# Altium schematic sheet POWERDIST_DARNET_2022.SchDoc
size B; SheetNumber: 1; SheetTotal: 1
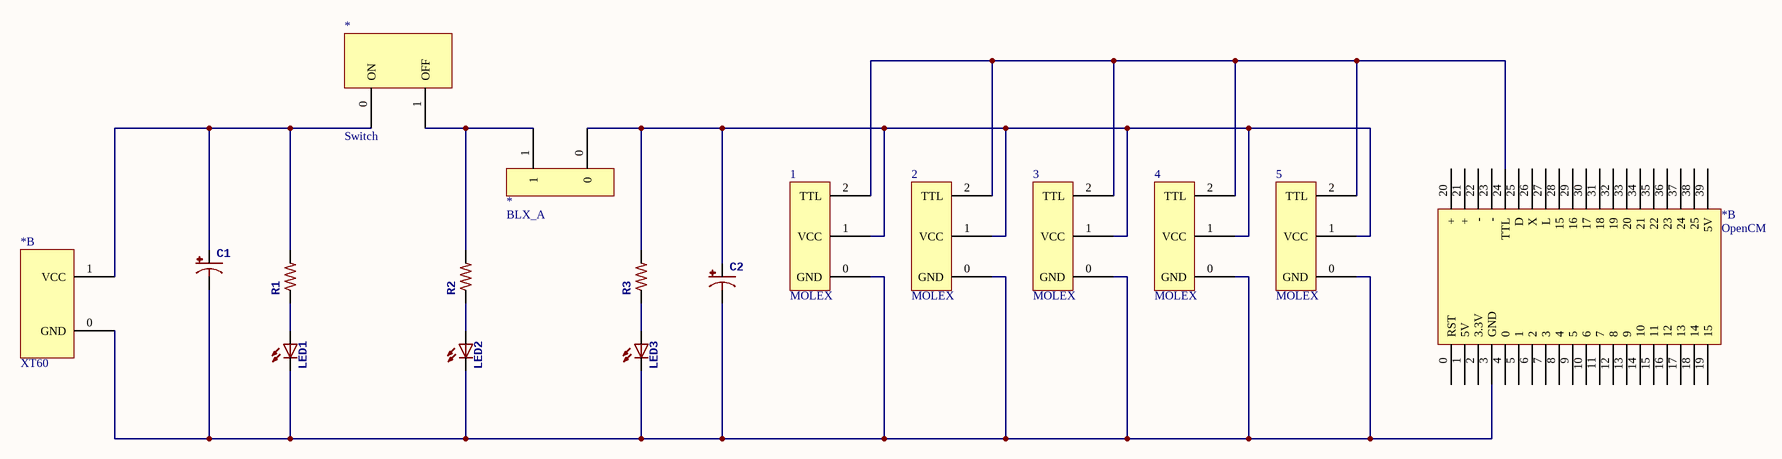
[diagram p0: POWERDIST_DARNET_2022.SchDoc]

## Parts
(Parts that share a designator on the sheet are numbered #1, #2 ... from top to bottom, then left to right.)
1  MOLEX  [MOLEX]
2  MOLEX  [MOLEX]
3  MOLEX  [MOLEX]
4  MOLEX  [MOLEX]
5  MOLEX  [MOLEX]
*#1  Switch  [Switch]
*#2  BLX_A  [BLX_A]
*#3  OpenCM  [OpenCM]  (part B of 2)
*#4  XT60  [XT60]  (part B of 2)
C1  (no value)  [CPOL-RADIAL-10UF-25V]
C2  (no value)  [CPOL-RADIAL-10UF-25V]
LED1  (no value)  [LED5MM]
LED2  (no value)  [LED5MM]
LED3  (no value)  [LED5MM]
R1  (no value)  [AXIAL-0.5]
R2  (no value)  [AXIAL-0.5]
R3  (no value)  [AXIAL-0.5]

## Nets
Net1_0: 1.0(GND) 2.0(GND) 3.0(GND) 4.0(GND) 5.0(GND) *#3.3(GND) *#4.0(GND) C1.2(-) C2.2(-) LED1.K(C) LED2.K(C) LED3.K(C)
Net1_1: 1.1(VCC) 2.1(VCC) 3.1(VCC) 4.1(VCC) 5.1(VCC) *#2.0 C2.1(+) R3.P$2
Net1_2: 1.2(TTL) 2.2(TTL) 3.2(TTL) 4.2(TTL) 5.2(TTL) *#3.24(TTL)
Net*#1_0: *#1.0(ON) *#4.1(VCC) C1.1(+) R1.P$2
Net*#1_1: *#1.1(OFF) *#2.1 R2.P$2
NetLED1_A: LED1.A R1.P$1
NetLED2_A: LED2.A R2.P$1
NetLED3_A: LED3.A R3.P$1

Not connected (* = marked no-connect by the designer): *#3 0(RST) 1(5V) 2(3.3V) 4(0) 5(1) 6(2) 7(3) 8(4) 9(5) 10(6) 11(7) 12(8) 13(9) 14(10) 15(11) 16(12) 17(13) 18(14) 19(15) 20(+) 21(+) 22(-) 23(-) 25(D) 26(X) 27(L) 28(15) 29(16) 30(17) 31(18) 32(19) 33(20) 34(21) 35(22) 36(23) 37(24) 38(25) 39(5V)

## Library data of the parts
C1 C2 = CAP_POLPTH2
LED1-LED3 = LED5MM
R1-R3 = RESISTORPTH-1/2W